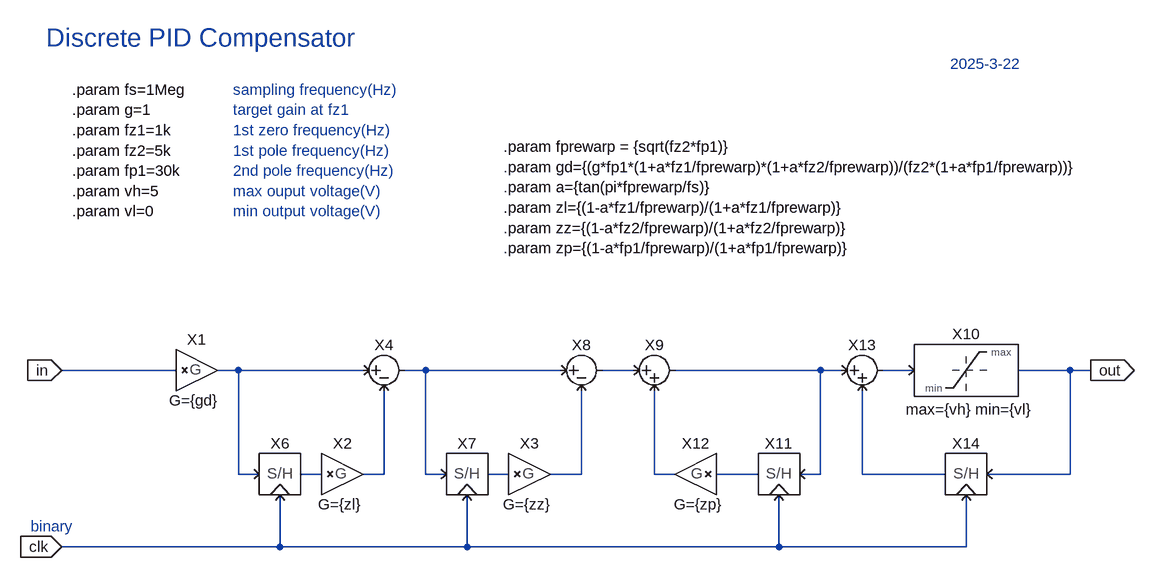
[diagram p0: schematic zPID.asc]
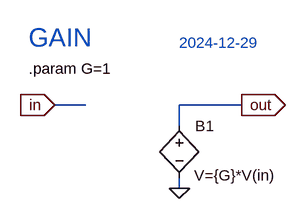
[diagram p1: sub-circuit gain.asc]
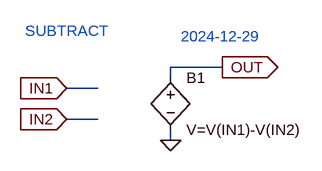
[diagram p2: sub-circuit sub.asc]
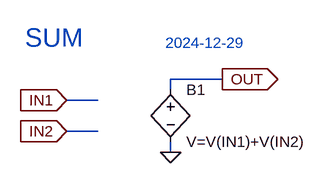
[diagram p3: sub-circuit sum.asc]
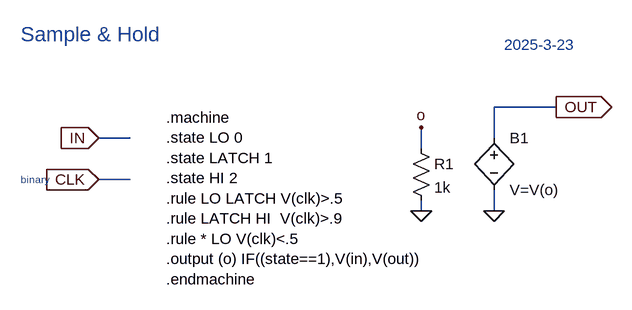
[diagram p4: sub-circuit samplehold.asc]
zPID.asc, the LTspice schematic file:
Version 4
SHEET 1 1624 680
WIRE -64 144 -240 144
WIRE 32 144 0 144
WIRE 224 144 32 144
WIRE 320 144 288 144
WIRE 528 144 320 144
WIRE 640 144 592 144
WIRE 928 144 704 144
WIRE 960 144 928 144
WIRE 1072 144 1024 144
WIRE 1312 144 1232 144
WIRE 1344 144 1312 144
WIRE 32 304 32 144
WIRE 64 304 32 304
WIRE 160 304 128 304
WIRE 256 304 256 176
WIRE 256 304 224 304
WIRE 320 304 320 144
WIRE 352 304 320 304
WIRE 448 304 416 304
WIRE 560 304 560 176
WIRE 560 304 512 304
WIRE 672 304 672 176
WIRE 704 304 672 304
WIRE 832 304 768 304
WIRE 928 304 928 144
WIRE 928 304 896 304
WIRE 992 304 992 176
WIRE 1120 304 992 304
WIRE 1312 304 1312 144
WIRE 1312 304 1184 304
WIRE 96 416 96 336
WIRE 96 416 -240 416
WIRE 384 416 384 336
WIRE 384 416 96 416
WIRE 864 416 864 336
WIRE 864 416 384 416
WIRE 1152 416 1152 336
WIRE 1152 416 864 416
FLAG -240 416 clk
IOPIN -240 416 In
FLAG -240 144 in
IOPIN -240 144 In
FLAG 1344 144 out
IOPIN 1344 144 Out
SYMBOL PowerSim\\GAIN -32 144 R0
WINDOW 39 -4 62 Bottom 2
SYMATTR SpiceLine G={gd}
SYMATTR InstName X1
SYMBOL PowerSim\\GAIN 192 304 R0
WINDOW 39 -4 62 Bottom 2
SYMATTR SpiceLine G={zl}
SYMATTR InstName X2
SYMBOL PowerSim\\GAIN 480 304 R0
WINDOW 39 -4 62 Bottom 2
SYMATTR SpiceLine G={zz}
SYMATTR InstName X3
SYMBOL PowerSim\\SUB 256 144 R0
SYMATTR InstName X4
SYMBOL PowerSim\\SUB 560 144 R0
SYMATTR InstName X8
SYMBOL PowerSim\\SUM 672 144 R0
SYMATTR InstName X9
SYMBOL PowerSim\\LIMIT 1152 144 R0
WINDOW 39 5 76 Bottom 2
SYMATTR SpiceLine max={vh} min={vl}
SYMATTR InstName X10
SYMBOL PowerSim\\GAIN 736 304 M0
WINDOW 39 -4 62 Bottom 2
SYMATTR SpiceLine G={zp}
SYMATTR InstName X12
SYMBOL PowerSim\\SUM 992 144 R0
SYMATTR InstName X13
SYMBOL PowerSim\\SAMPLEHOLD 96 304 R0
SYMATTR InstName X6
SYMBOL PowerSim\\SAMPLEHOLD 384 304 R0
SYMATTR InstName X7
SYMBOL PowerSim\\SAMPLEHOLD 864 304 M0
SYMATTR InstName X11
SYMBOL PowerSim\\SAMPLEHOLD 1152 304 M0
SYMATTR InstName X14
TEXT -224 -288 Left 2 !.param fs=1Meg\n.param g=1\n.param fz1=1k\n.param fz2=5k\n.param fp1=30k\n.param vh=5\n.param vl=0
TEXT -264 -368 Left 4 ;Discrete PID Compensator
TEXT -288 384 Left 2 ;binary
TEXT 24 -288 Left 2 ;sampling frequency(Hz)\ntarget gain at fz1\n1st zero frequency(Hz)\n1st pole frequency(Hz)\n2nd pole frequency(Hz)\nmax ouput voltage(V)\nmin output voltage(V)
TEXT 1128 -328 Left 2 ;2025-3-22
TEXT 440 -200 Left 2 !.param fprewarp = {sqrt(fz2*fp1)}\n.param gd={(g*fp1*(1+a*fz1/fprewarp)*(1+a*fz2/fprewarp))/(fz2*(1+a*fp1/fprewarp))}\n.param a={tan(pi*fprewarp/fs)}\n.param zl={(1-a*fz1/fprewarp)/(1+a*fz1/fprewarp)}\n.param zz={(1-a*fz2/fprewarp)/(1+a*fz2/fprewarp)}\n.param zp={(1-a*fp1/fprewarp)/(1+a*fp1/fprewarp)}

gain.asc, the sub-circuit schematic file:
Version 4
SHEET 1 880 680
WIRE 0 64 -48 64
WIRE 240 64 144 64
WIRE 144 96 144 64
WIRE 144 192 144 176
FLAG 144 192 0
FLAG 240 64 out
IOPIN 240 64 Out
FLAG -48 64 in
IOPIN -48 64 In
SYMBOL bv 144 80 R0
WINDOW 3 23 92 Left 2
SYMATTR Value V={G}*V(in)
SYMATTR InstName B1
TEXT -88 8 Left 2 !.param G=1
TEXT -88 -40 Left 4 ;GAIN
TEXT 144 -32 Left 2 ;2024-12-29

sub.asc, the sub-circuit schematic file:
Version 4
SHEET 1 880 680
WIRE 288 96 208 96
WIRE 208 112 208 96
WIRE 96 128 48 128
WIRE 96 176 48 176
WIRE 208 208 208 192
FLAG 48 128 IN1
IOPIN 48 128 In
FLAG 48 176 IN2
IOPIN 48 176 In
FLAG 208 208 0
FLAG 288 96 OUT
IOPIN 288 96 Out
SYMBOL bv 208 96 R0
SYMATTR InstName B1
SYMATTR Value V=V(IN1)-V(IN2)
TEXT -16 40 Left 2 ;SUBTRACT
TEXT 224 48 Left 2 ;2024-12-29

sum.asc, the sub-circuit schematic file:
Version 4
SHEET 1 880 680
WIRE 288 96 208 96
WIRE 208 112 208 96
WIRE 96 128 48 128
WIRE 96 176 48 176
WIRE 208 208 208 192
FLAG 48 128 IN1
IOPIN 48 128 In
FLAG 48 176 IN2
IOPIN 48 176 In
FLAG 208 208 0
FLAG 288 96 OUT
IOPIN 288 96 Out
SYMBOL bv 208 96 R0
SYMATTR InstName B1
SYMATTR Value V=V(IN1)+V(IN2)
TEXT -16 32 Left 4 ;SUM
TEXT 200 40 Left 2 ;2024-12-29

samplehold.asc, the sub-circuit schematic file:
Version 4
SHEET 1 880 680
WIRE 576 -560 480 -560
WIRE -80 -512 -128 -512
WIRE 480 -512 480 -560
WIRE 368 -496 368 -528
WIRE -80 -448 -128 -448
WIRE 368 -400 368 -416
WIRE 480 -400 480 -432
FLAG -128 -512 IN
IOPIN -128 -512 In
FLAG -128 -448 CLK
IOPIN -128 -448 In
FLAG 576 -560 OUT
IOPIN 576 -560 Out
FLAG 368 -400 0
FLAG 368 -528 o
FLAG 480 -400 0
SYMBOL res 352 -512 R0
SYMATTR InstName R1
SYMATTR Value 1k
SYMBOL bv 480 -528 R0
SYMATTR InstName B1
SYMATTR Value V=V(o)
TEXT -248 -672 Left 3 ;Sample & Hold
TEXT -248 -448 Left 1 ;binary
TEXT 496 -656 Left 2 ;2025-3-23
TEXT -24 -544 Left 2 !.machine\n.state LO 0\n.state LATCH 1\n.state HI 2\n.rule LO LATCH V(clk)>.5\n.rule LATCH HI  V(clk)>.9\n.rule * LO V(clk)<.5\n.output (o) IF((state==1),V(in),V(out))  \n.endmachine

The netlist it stands for:
* zPID.asc
XX1 in N001 gain params: G={gd}
XX2 N006 N007 gain params: G={zl}
XX3 N008 N009 gain params: G={zz}
XX4 N001 N007 N002 sub
XX8 N002 N009 N003 sub
XX9 N003 N010 N004 sum
XX10 N005 out LIMIT max={vh} min={vl}  ; pins in out
XX12 N011 N010 gain params: G={zp}
XX13 N004 N012 N005 sum
XX6 clk N001 N006 samplehold
XX7 clk N002 N008 samplehold
XX11 clk N004 N011 samplehold
XX14 clk out N012 samplehold

* block symbol definitions
.subckt gain in out
B1 out 0 V={G}*V(in)
.param G=1
* GAIN
* 2024-12-29
.ends gain

.subckt sub in1 in2 out
B1 OUT 0 V=V(IN1)-V(IN2)
* SUBTRACT
* 2024-12-29
.ends sub

.subckt sum in1 in2 out
B1 OUT 0 V=V(IN1)+V(IN2)
* SUM
* 2024-12-29
.ends sum

.subckt samplehold CLK IN OUT
R1 o 0 1k
B1 OUT 0 V=V(o)
* Sample & Hold
* binary
* 2025-3-23
.machine
.state LO 0
.state LATCH 1
.state HI 2
.rule LO LATCH V(clk)>.5
.rule LATCH HI  V(clk)>.9
.rule * LO V(clk)<.5
.output (o) IF((state==1),V(in),V(out))
.endmachine
.ends samplehold

.param fs=1Meg
.param g=1
.param fz1=1k
.param fz2=5k
.param fp1=30k
.param vh=5
.param vl=0
* Discrete PID Compensator
* binary
* sampling frequency(Hz)
* target gain at fz1
* 1st zero frequency(Hz)
* 1st pole frequency(Hz)
* 2nd pole frequency(Hz)
* max ouput voltage(V)
* min output voltage(V)
* 2025-3-22
.param fprewarp = {sqrt(fz2*fp1)}
.param gd={(g*fp1*(1+a*fz1/fprewarp)*(1+a*fz2/fprewarp))/(fz2*(1+a*fp1/fprewarp))}
.param a={tan(pi*fprewarp/fs)}
.param zl={(1-a*fz1/fprewarp)/(1+a*fz1/fprewarp)}
.param zz={(1-a*fz2/fprewarp)/(1+a*fz2/fprewarp)}
.param zp={(1-a*fp1/fprewarp)/(1+a*fp1/fprewarp)}
.backanno
.end